# EAGLE schematic ext (EAGLE 9.6.1)
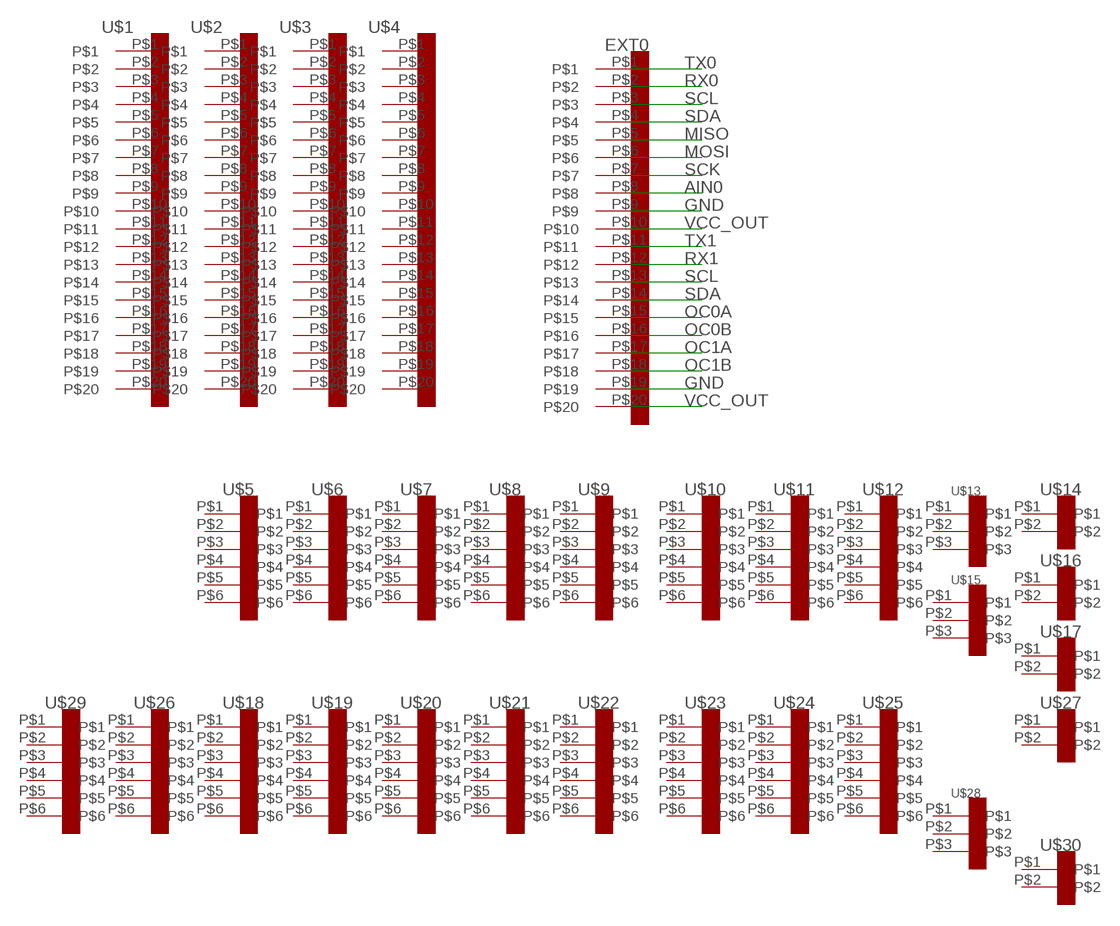
[diagram p0: schematic, sheet 1]

## Parts
EXT0  CON_DIL_20  [CON_DIL_20]
U$1  CON_DIL_20  [CON_DIL_20]
U$2  CON_DIL_20  [CON_DIL_20]
U$3  CON_DIL_20  [CON_DIL_20]
U$4  CON_DIL_20  [CON_DIL_20]
U$5  CON_DIL_6  [CON_DIL_6]
U$6  CON_DIL_6  [CON_DIL_6]
U$7  CON_DIL_6  [CON_DIL_6]
U$8  CON_DIL_6  [CON_DIL_6]
U$9  CON_DIL_6  [CON_DIL_6]
U$10  CON_DIL_6  [CON_DIL_6]
U$11  CON_DIL_6  [CON_DIL_6]
U$12  CON_DIL_6  [CON_DIL_6]
U$13  CON_DIL_3  [CON_DIL_3]
U$14  CON_DIL_2  [CON_DIL_2]
U$15  CON_DIL_3  [CON_DIL_3]
U$16  CON_DIL_2  [CON_DIL_2]
U$17  CON_DIL_2  [CON_DIL_2]
U$18  CON_DIL_6  [CON_DIL_6]
U$19  CON_DIL_6  [CON_DIL_6]
U$20  CON_DIL_6  [CON_DIL_6]
U$21  CON_DIL_6  [CON_DIL_6]
U$22  CON_DIL_6  [CON_DIL_6]
U$23  CON_DIL_6  [CON_DIL_6]
U$24  CON_DIL_6  [CON_DIL_6]
U$25  CON_DIL_6  [CON_DIL_6]
U$26  CON_DIL_6  [CON_DIL_6]
U$27  CON_DIL_2  [CON_DIL_2]
U$28  CON_DIL_3  [CON_DIL_3]
U$29  CON_DIL_6  [CON_DIL_6]
U$30  CON_DIL_2  [CON_DIL_2]

## Nets
AIN0: EXT0.P$8
GND: EXT0.P$9 EXT0.P$19
MISO: EXT0.P$5
MOSI: EXT0.P$6
OC0A: EXT0.P$15
OC0B: EXT0.P$16
OC1A: EXT0.P$17
OC1B: EXT0.P$18
RX0: EXT0.P$2
RX1: EXT0.P$12
SCK: EXT0.P$7
SCL: EXT0.P$3 EXT0.P$13
SDA: EXT0.P$4 EXT0.P$14
TX0: EXT0.P$1
TX1: EXT0.P$11
VCC_OUT: EXT0.P$10 EXT0.P$20
Unconnected: U$1.P$1 U$1.P$2 U$1.P$3 U$1.P$4 U$1.P$5 U$1.P$6 U$1.P$7 U$1.P$8 U$1.P$9 U$1.P$10 U$1.P$11 U$1.P$12 U$1.P$13 U$1.P$14 U$1.P$15 U$1.P$16 U$1.P$17 U$1.P$18 U$1.P$19 U$1.P$20 U$2.P$1 U$2.P$2 U$2.P$3 U$2.P$4 U$2.P$5 U$2.P$6 U$2.P$7 U$2.P$8 U$2.P$9 U$2.P$10 U$2.P$11 U$2.P$12 U$2.P$13 U$2.P$14 U$2.P$15 U$2.P$16 U$2.P$17 U$2.P$18 U$2.P$19 U$2.P$20 U$3.P$1 U$3.P$2 U$3.P$3 U$3.P$4 U$3.P$5 U$3.P$6 U$3.P$7 U$3.P$8 U$3.P$9 U$3.P$10 U$3.P$11 U$3.P$12 U$3.P$13 U$3.P$14 U$3.P$15 U$3.P$16 U$3.P$17 U$3.P$18 U$3.P$19 U$3.P$20 U$4.P$1 U$4.P$2 U$4.P$3 U$4.P$4 U$4.P$5 U$4.P$6 U$4.P$7 U$4.P$8 U$4.P$9 U$4.P$10 U$4.P$11 U$4.P$12 U$4.P$13 U$4.P$14 U$4.P$15 U$4.P$16 U$4.P$17 U$4.P$18 U$4.P$19 U$4.P$20 U$5.P$1 U$5.P$2 U$5.P$3 U$5.P$4 U$5.P$5 U$5.P$6 U$6.P$1 U$6.P$2 U$6.P$3 U$6.P$4 U$6.P$5 U$6.P$6 U$7.P$1 U$7.P$2 U$7.P$3 U$7.P$4 U$7.P$5 U$7.P$6 U$8.P$1 U$8.P$2 U$8.P$3 U$8.P$4 U$8.P$5 U$8.P$6 U$9.P$1 U$9.P$2 U$9.P$3 U$9.P$4 U$9.P$5 U$9.P$6 U$10.P$1 U$10.P$2 U$10.P$3 U$10.P$4 U$10.P$5 U$10.P$6 U$11.P$1 U$11.P$2 U$11.P$3 U$11.P$4 U$11.P$5 U$11.P$6 U$12.P$1 U$12.P$2 U$12.P$3 U$12.P$4 U$12.P$5 U$12.P$6 U$13.P$1 U$13.P$2 U$13.P$3 U$14.P$1 U$14.P$2 U$15.P$1 U$15.P$2 U$15.P$3 U$16.P$1 U$16.P$2 U$17.P$1 U$17.P$2 U$18.P$1 U$18.P$2 U$18.P$3 U$18.P$4 U$18.P$5 U$18.P$6 U$19.P$1 U$19.P$2 U$19.P$3 U$19.P$4 U$19.P$5 U$19.P$6 U$20.P$1 U$20.P$2 U$20.P$3 U$20.P$4 U$20.P$5 U$20.P$6 U$21.P$1 U$21.P$2 U$21.P$3 U$21.P$4 U$21.P$5 U$21.P$6 U$22.P$1 U$22.P$2 U$22.P$3 U$22.P$4 U$22.P$5 U$22.P$6 U$23.P$1 U$23.P$2 U$23.P$3 U$23.P$4 U$23.P$5 U$23.P$6 U$24.P$1 U$24.P$2 U$24.P$3 U$24.P$4 U$24.P$5 U$24.P$6 U$25.P$1 U$25.P$2 U$25.P$3 U$25.P$4 U$25.P$5 U$25.P$6 U$26.P$1 U$26.P$2 U$26.P$3 U$26.P$4 U$26.P$5 U$26.P$6 U$27.P$1 U$27.P$2 U$28.P$1 U$28.P$2 U$28.P$3 U$29.P$1 U$29.P$2 U$29.P$3 U$29.P$4 U$29.P$5 U$29.P$6 U$30.P$1 U$30.P$2

## Library data of the parts
EXT0 U$1-U$4 = connector:CON_DIL_20
U$5-U$12 U$18-U$26 U$29 = connector:CON_DIL_6
U$13 U$15 U$28 = connector:CON_DIL_3
U$14 U$16 U$17 U$27 U$30 = connector:CON_DIL_2